# Altium schematic sheet Sheet1.SchDoc
size A3; SheetNumber: 1; SheetTotal: 1
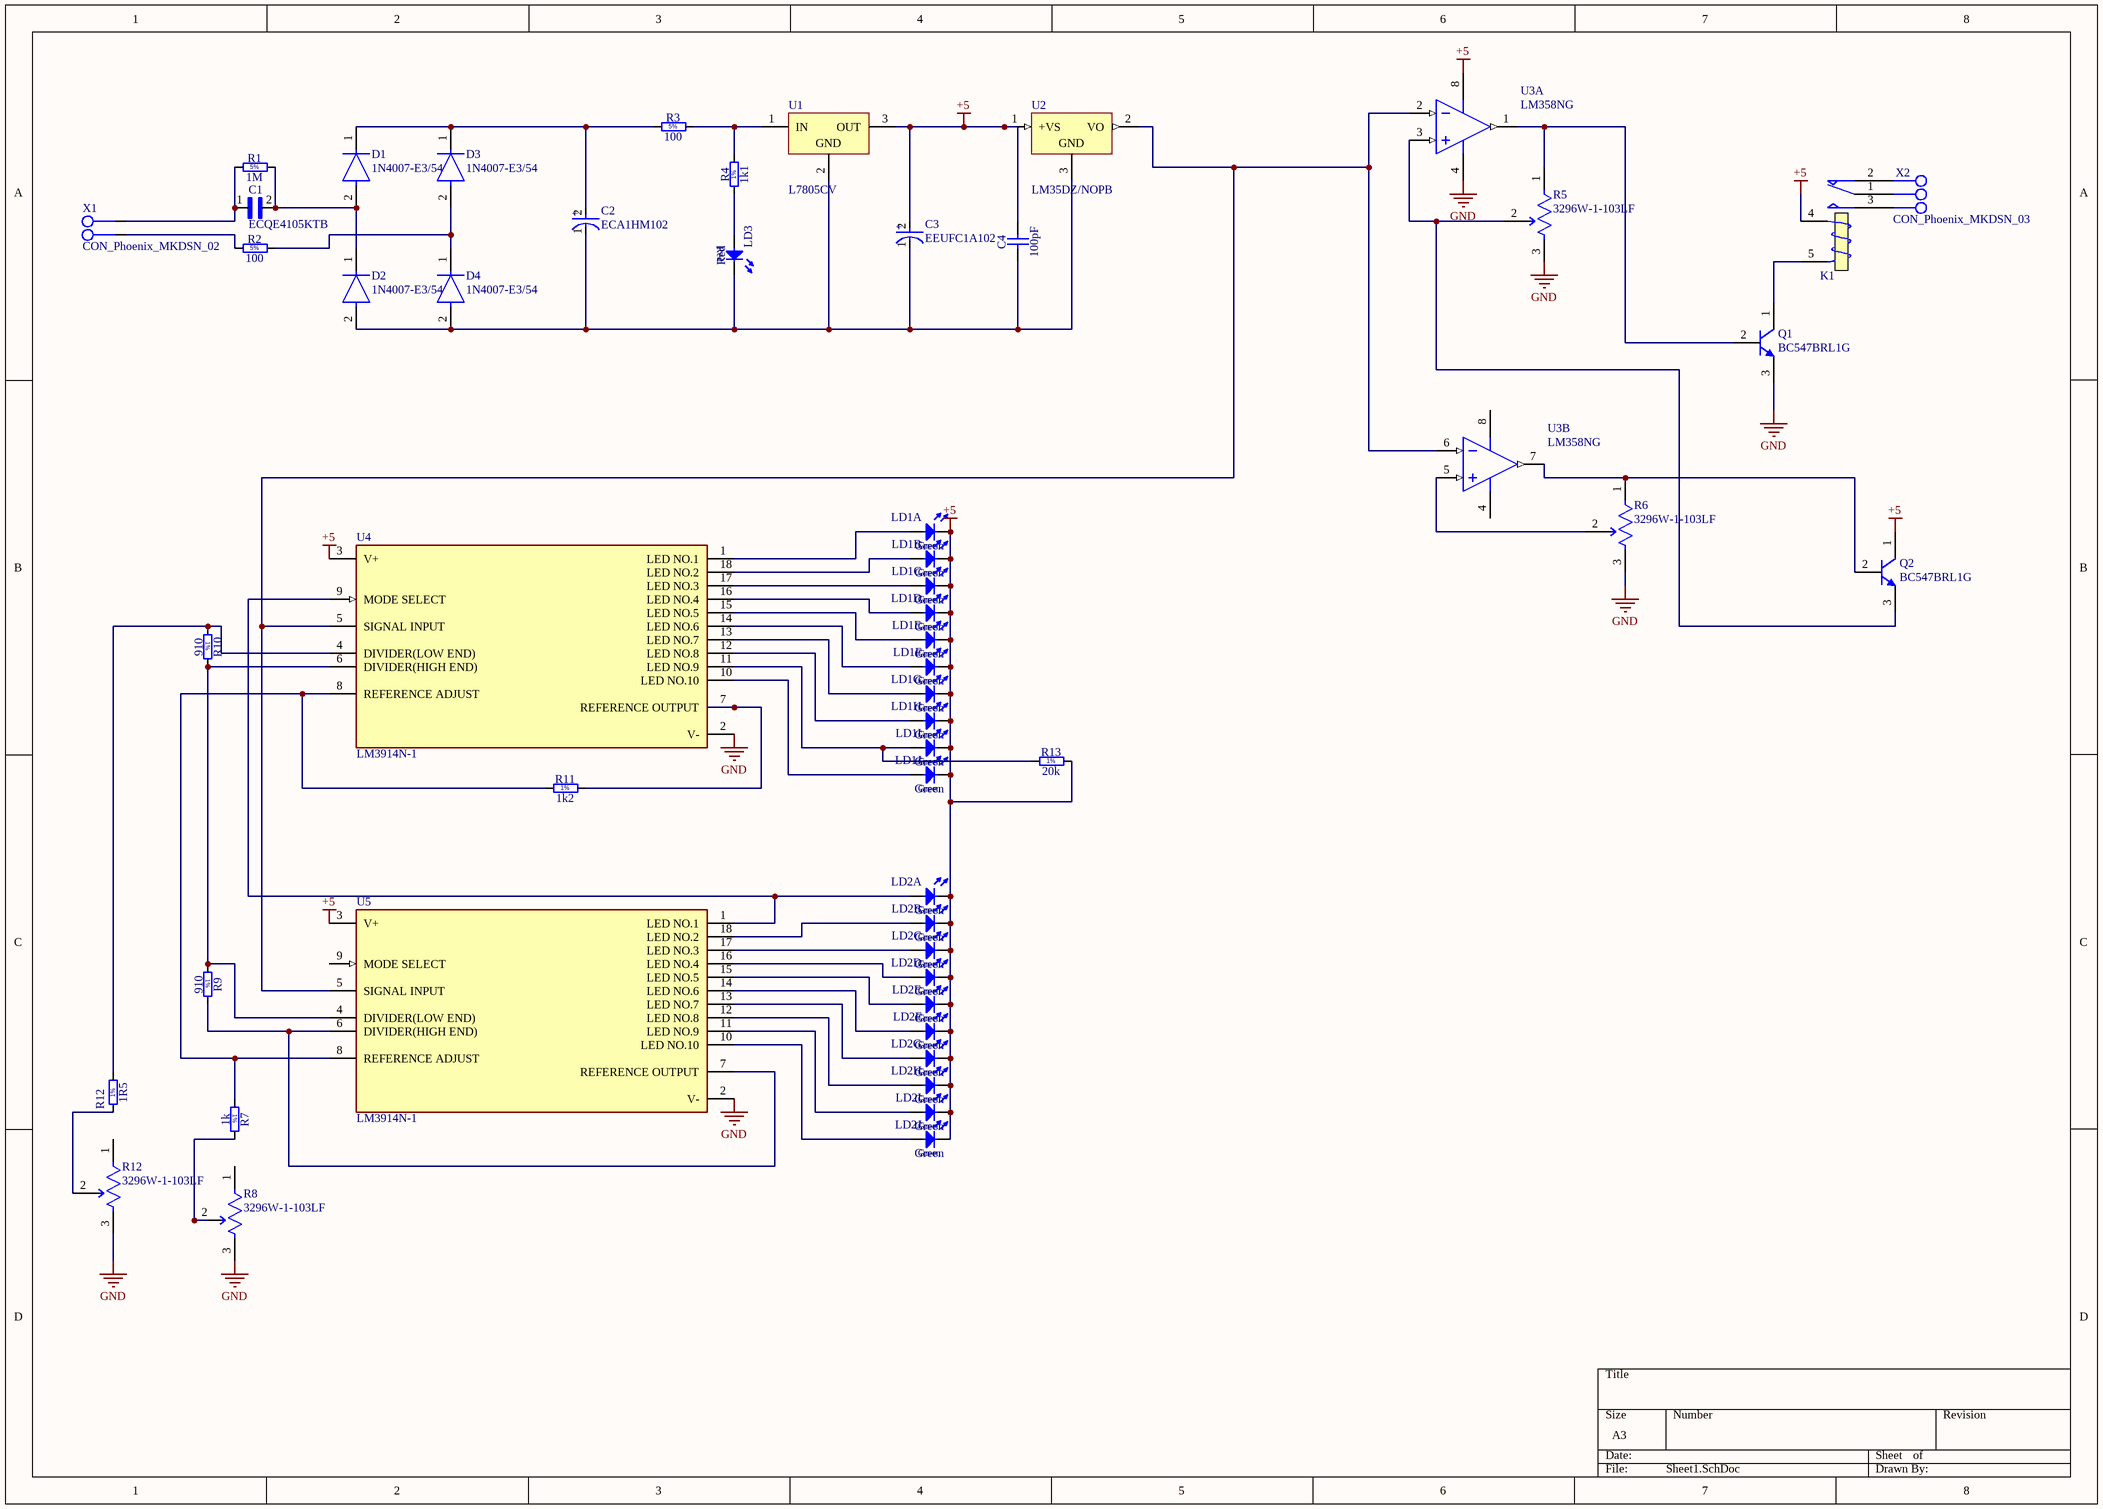
[diagram p0: Sheet1.SchDoc]

## Parts
(Parts that share a designator on the sheet are numbered #1, #2 ... from top to bottom, then left to right.)
C1  ECQE4105KTB  [CAPRR1500W80L2650T850H2300]
C2  ECA1HM102  [FP-RAD-TH-D_12_5_0_5-L_25-MFG]
C3  EEUFC1A102  [FP-RAD-TH-D_10_0_5-L_16_1-MFG]
C4  100pF  [CAPRR508-254X381X584]
D1  1N4007-E3/54  [FP-1N4007-MFG]
D2  1N4007-E3/54  [FP-1N4007-MFG]
D3  1N4007-E3/54  [FP-1N4007-MFG]
D4  1N4007-E3/54  [FP-1N4007-MFG]
K1  Relay 5pin Milon 5V  [REL_MILON]  (value not drawn)
LD1  Green  [LED_MENTOR_2633.1180]  (parts A,B,C,D,E,F,G,H,I,J of 10)
LD2  Green  [LED_MENTOR_2633.1180]  (parts A,B,C,D,E,F,G,H,I,J of 10)
LD3  Red  [LED_3MM_RED_1C-2A]
Q1  BC547BRL1G  [ONSC-TO-92-3-29-11_AM_BL]
Q2  BC547BRL1G  [ONSC-TO-92-3-29-11_AM_BL]
R1  1M  [RES2286-1670X520]
R2  100  [RES2286-1670X520]
R3  100  [RES2286-1670X520]
R4  1k1  [RES1016-630X250]
R5  3296W-1-103LF  [FP-3296W-MFG]
R6  3296W-1-103LF  [FP-3296W-MFG]
R7  1k  [RES1016-630X250]
R8  3296W-1-103LF  [FP-3296W-MFG]
R9  910  [RES1016-630X250]
R10  910  [RES1016-630X250]
R11  1k2  [RES1016-630X250]
R12#1  1R5  [RES1016-630X250]
R12#2  3296W-1-103LF  [FP-3296W-MFG]
R13  20k  [RES1016-630X250]
U1  L7805CV  [TO220]
U2  LM35DZ/NOPB  [LP0003A]
U3  LM358NG  [ONSC-PDIP-8-626-05_M]  (parts A,B of 2)
U4  LM3914N-1  [FP-NFK0018A-MFG]
U5  LM3914N-1  [FP-NFK0018A-MFG]
X1  CON_Phoenix_MKDSN_02  [CON_MKDSN1,5/2-5,08]
X2  CON_Phoenix_MKDSN_03  [CON_MKDSN1,5/3-5,08]

## Nets
+5: C3.2(A) C4.2 K1.4(T1) LD1.C1 LD1.C2 LD1.C3 LD1.C4 LD1.C5 LD1.C6 LD1.C7 LD1.C8 LD1.C9 LD1.C10 LD2.C1 LD2.C2 LD2.C3 LD2.C4 LD2.C5 LD2.C6 LD2.C7 LD2.C8 LD2.C9 LD2.C10 Q2.1(C) R13.2 U1.3(OUT) U2.1(+VS) U3.8(VCC) U4.3(V+) U5.3(V+)
GND: Q1.3(E) R5.3(CW) R6.3(CW) R8.3(CW) R12#2.3(CW) U3.4(VEE/GND) U4.2(V-) U5.2(V-)
NetC1_1: C1.1 R1.1 X1.2
NetC1_2: C1.2 D1.2(A) D2.1(C) R1.2
NetC2_1: C2.1(C) C3.1(C) C4.1 D2.2(A) D4.2(A) LD3.1(C) U1.2(GND) U2.3(GND)
NetC2_2: C2.2(A) D1.1(C) D3.1(C) R3.1
NetD3_2: D3.2(A) D4.1(C) R2.2
NetK1_1: K1.1(COM) X2.2
NetK1_2: K1.2(NC) X2.1
NetK1_3: K1.3(NO) X2.3
NetK1_5: K1.5(T2) Q1.1(C)
NetLD1_A1: LD1.A1 U4.1(LED_NO.1)
NetLD1_A2: LD1.A2 U4.18(LED_NO.2)
NetLD1_A3: LD1.A3 U4.17(LED_NO.3)
NetLD1_A4: LD1.A4 U4.16(LED_NO.4)
NetLD1_A5: LD1.A5 U4.15(LED_NO.5)
NetLD1_A6: LD1.A6 U4.14(LED_NO.6)
NetLD1_A7: LD1.A7 U4.13(LED_NO.7)
NetLD1_A8: LD1.A8 U4.12(LED_NO.8)
NetLD1_A9: LD1.A9 R13.1 U4.11(LED_NO.9)
NetLD1_A10: LD1.A10 U4.10(LED_NO.10)
NetLD2_A1: LD2.A1 U4.9(MODE_SELECT) U5.1(LED_NO.1)
NetLD2_A2: LD2.A2 U5.18(LED_NO.2)
NetLD2_A3: LD2.A3 U5.17(LED_NO.3)
NetLD2_A4: LD2.A4 U5.16(LED_NO.4)
NetLD2_A5: LD2.A5 U5.15(LED_NO.5)
NetLD2_A6: LD2.A6 U5.14(LED_NO.6)
NetLD2_A7: LD2.A7 U5.13(LED_NO.7)
NetLD2_A8: LD2.A8 U5.12(LED_NO.8)
NetLD2_A9: LD2.A9 U5.11(LED_NO.9)
NetLD2_A10: LD2.A10 U5.10(LED_NO.10)
NetLD3_2: LD3.2(A) R4.1
NetQ1_2: Q1.2(B) R5.1(CCW) U3.1(OUTA)
NetQ2_2: Q2.2(B) R6.1(CCW) U3.7(OUTB)
NetQ2_3: Q2.3(E) R5.2(WIPER) U3.3(INA+)
NetR2_1: R2.1 X1.1
NetR3_2: R3.2 R4.2 U1.1(IN)
NetR6_2: R6.2(WIPER) U3.5(INB+)
NetR7_1: R7.1 R11.1 U4.8(REFERENCE_ADJUST) U5.8(REFERENCE_ADJUST)
NetR7_2: R7.2 R8.2(WIPER)
NetR9_1: R9.1 R10.2 U4.6(DIVIDER(HIGH_END)) U5.4(DIVIDER(LOW_END))
NetR9_2: R9.2 U5.6(DIVIDER(HIGH_END)) U5.7(REFERENCE_OUTPUT)
NetR10_1: R10.1 R12#1.2 U4.4(DIVIDER(LOW_END))
NetR11_2: R11.2 U4.7(REFERENCE_OUTPUT)
NetR12#1_1: R12#1.1 R12#2.2(WIPER)
NetU2_2: U2.2(VO) U3.2(INA-) U3.6(INB-) U4.5(SIGNAL_INPUT) U5.5(SIGNAL_INPUT)

Not connected (* = marked no-connect by the designer): R8 1(CCW); R12#2 1(CCW); U5 9(MODE_SELECT)

## Notes on the sheet
- (in symbol CMP-05427-000979-1) +
- (in symbol CMP-05427-001975-1) +
- (in symbol RMF_1K1_1%_0.6W_50PPM_1016-630X250) 1%
- (in symbol RMF_1K2_1%_0.6W_50PPM_1016-630X250) 1%
- (in symbol RMF_1K_1%_0.6W_50PPM_1016-630X250) 1%
- (in symbol RMF_1M_5%_3W_250PPM_2286-1670X520) 5%
- (in symbol RMF_1R5_1%_0.6W_50PPM_1016-630X250) 1%
- (in symbol RMF_20K_1%_0.6W_50PPM_1016-630X250) 1%
- (in symbol RMF_100R_5%_3W_250PPM_2286-1670X520) 5%
- (in symbol RMF_910R_1%_0.6W_50PPM_1016-630X250) 1%

## Library data of the parts
C2 = CMP-05427-001975-1: Aluminum Electrolytic Capacitors (Radial Lead Type) 1000uF ±20% 50V; Lead Diameter: 0.6mm; Polarity: Polar; Lead/Base Style: Straight; Ripple Current: 1.05A; Life (Hours): 2000Hour; Dissipation Factor: 0.12%; Capacitance: 1mF; Diameter: 12.5mm; Height: 25mm; Construction: RADIAL; Voltage Rating (DC): 50V; Tolerance: 20%; Package Quantity: 200; Min Operating Temperature: -40°C; Packaging: Bulk; Max Operating Temperature: 85°C; Case/Package: Radial; Radiation Hardening: No; Mount: Through Hole; Length: 25mm; Termination: Radial; Voltage Rating: 50V; RoHS Compliant: Yes; Height - Seated (Max): 1.063inch; REACH SVHC: No SVHC; Series: M; Lead Pitch: 5mm
C3 = CMP-05427-000979-1: Aluminum Electrolytic Capacitors (Radial Lead Type) AEC-Q200 Qualified 1000uF ±20% 10V; Leakage Current: 3uA; Lead Diameter: 0.6mm; Ripple Current: 1.05A; ESR (Equivalent Series Resistance): 68mR; Life (Hours): 3000Hour; Capacitance: 1mF; Dielectric Material: Aluminium; Packaging: Bulk; Lead Free: Lead Free; Min Operating Temperature: -55°C; Case/Package: Radial; Mount: Through Hole; Termination: Radial; Voltage: 10V; Height: 16mm; Lead Pitch: 5mm; RoHS Compliant: Yes; Voltage Rating (DC): 10V; Length: 16mm; Package Quantity: 200; Max Operating Temperature: 105°C; Ratings: AEC-Q200; Radiation Hardening: No; Contact Plating: Tin; Size: 16mm; Height - Seated (Max): 0.63inch; Diameter: 10mm; REACH SVHC: No SVHC; Series: FC; Construction: RADIAL; Voltage Rating: 10V; Tolerance: 20%; Impedance: 68mR
C4 = CCR_100PF_100V_5%_COG_508-254X381X584: Non-polarised capacitor; Part Description: Radial Lead Type Multilayer Ceramic Capacitor; Manufacturer: GENERIC; Manufacturer1 Part Number: C317C101J1G5TA; Voltage: 100VDC; TC: COG; Tolerance: ±5%; Table: Capacitors THD; Part Number: CCR_100PF_100V_5%_COG_508-254X381X584; Component Kind: Standard; Component Type: Standard; Pin Count: 2; Value: 100pF; Status: None; Manufacturer Part Number: CCR_100PF_100V_5%_COG_508-254X381X584; Case: LS5.08 W2.54 x L3.81 x H5.84; Mounted: Yes; Socket: No; SMD: No; ComponentHeight: 5.84mm; Manufacturer1 Example: KEMET; Manufacturer1 ComponentHeight: 5.84mm; HelpURL: \\cern.ch\dfs\Applications\Altium\Datasheets\CCR_KEMET_C317.pdf; Author: CERN DEM JLC; CreateDate: 12/17/2008; LatestRevisionDate: 12/17/2008
D1-D4 = CMP-02540-000046-1: DIODE GEN PURP 1KV 1A DO204AL; Manufacturer: Vishay; Value: 15pF; Max Junction Temp: +150°C; Max Surge Forward Current: 30A; Max Repetitive Reverse Voltage: 1000V; Peak Reverse Current: 30uA; Octopart: https://octopart.com/1n4007-e3%2F54-vishay-39548207; Digikey Description: DIODE GEN PURP 1KV 1A DO204AL; Category: Diode; Mouser Description: Rectifiers Vr/1000V Io/1A; Automotive: No; Package: 1N4007; Device Class L3: Rectifier Diodes; Temperature Range High: +150°C; Capacitance: 15pF; Ipc Land Pattern Name: DIOPA1088W105L520D270; Lead Free: Yes; ComponentLink2Description: Datasheet; Forward Current: 1A; Device Class L1: Discrete Semiconductors; ComponentLink2URL: http://www.vishay.com/docs/88503/1n4001.pdf; Temperature Range Low: -50°C; Height: 2.7mm; RoHS: TRUE; Temperature: -50°C to +150°C; Device Class L2: Diodes; Manufacturer Part Number: 1N4007-E3/54
K1 = Relay 5pin Milon 5V: PartNumber: HJR-21FF-S-Z-05VDC
LD1 LD2 = LED_MENTOR_2633.1180: 10x Diameter 5mm Green LED Vertical LED Array; Manufacturer: MENTOR; Table: LEDs & Displays; Part Number: LED_MENTOR_2633.1180; Component Kind: Standard; Component Type: Standard; Color: Green; PackageDescription: 10x Diameter 5mm Green LED Vertical LED Array; Part Description: 10x Diameter 5mm Green LED Vertical LED Array; Manufacturer Part Number: 2633.1180; Pin Count: 20; Mounted: Yes; Socket: No; SMD: No; ComponentHeight: 17.1mm; HelpURL: \\cern.ch\dfs\Applications\Altium\Datasheets\LED_MENTOR_2633.1180.pdf; Author: CERN DEM JLC; CreateDate: 11/28/2012; LatestRevisionDate: 3/7/2013
LD3 = LED_AVAGO_HLMP-1700: LED Red 1C 2A; Part Description: 3mm Red LED; Manufacturer: AVAGO TECHNOLOGIES; Table: LEDs & Displays; Part Number: LED_AVAGO_HLMP-1700; Component Kind: Standard; Component Type: Standard; Color: Red; PackageDescription: LED, Red, Body Dia. 3.43 mm, Pin spacing 2.54mm; Manufacturer Part Number: HLMP-1700; Pin Count: 2; Mounted: Yes; Socket: No; SMD: No; ComponentHeight: 6.35mm(min); HelpURL: \\cern.ch\dfs\Applications\Altium\Datasheets\LED_AVAGO_HLMP-1700.pdf; Author: CERN DEM JLC; CreateDate: 6/12/2008; LatestRevisionDate: 3/17/2010
Q1 Q2 = CMP-1048-01605-1: Amplifier Transistor, NPN Silicon, 3-Pin TO-92, Pb-Free, Tape and Reel; Manufacturer: On Semiconductor; IC Continuous (A): 0.1; fT Min (MHz): 150; ComponentLink2URL: http://www.onsemi.com/pub_link/Collateral/BC546-D.PDF; ComponentLink1URL: http://www.onsemi.com/; ComponentLink2Description: Datasheet; RoHS: TRUE; ComponentLink3Description: Package Specification; ComponentLink1Description: Manufacturer URL; ComponentLink3URL: http://www.onsemi.com/pub_link/Collateral/MAC97-D.PDF; PackageDescription: 3-Pin Transistor Outline, Body 4.825 x 3.685 mm, Pitch 1.27 mm; Packing: Tape and Reel; PackageVersion: Rev. AM; Polarity: NPN; DatasheetVersion: Rev. 7; Mounting Technology: Through Hole; PackageReference: TO-92-3-29-11_AM_BL; PartNumber: BC547BRL1G
R1 = RMF_1M_5%_3W_250PPM_2286-1670X520: Resistor - 5%; Part Description: Leaded Power Metal Film Resistor; Manufacturer: GENERIC; Manufacturer1 Part Number: PR03000201004JAC00; Power: 3W; TC: ±250ppm/°C; Table: Resistors THD; Part Number: RMF_1M_5%_3W_250PPM_2286-1670X520; Component Kind: Standard; Component Type: Standard; Pin Count: 2; Value: 1M; Status: Preferred; Tolerance: ±5%; Manufacturer Part Number: RMF_1M_5%_3W_250PPM_2286-1670X520; Case: LS22.86 L16.7 x D5.2; Mounted: Yes; Socket: No; SMD: No; ComponentHeight: 5.2mm; Manufacturer1 Example: VISHAY BCCOMPONENT; Manufacturer1 ComponentHeight: 5.2mm; HelpURL: \\cern.ch\dfs\Applications\Altium\Datasheets\RMF_VISHAY_PR03.pdf; Author: CERN DEM JLC; CreateDate: 6/23/2008; LatestRevisionDate: 10/1/2012
R2 R3 = RMF_100R_5%_3W_250PPM_2286-1670X520: Resistor - 5%; Part Description: Leaded Power Metal Film Resistor; Manufacturer: GENERIC; Manufacturer1 Part Number: PR03000201000JAC00; Power: 3W; TC: ±250ppm/°C; Table: Resistors THD; Part Number: RMF_100R_5%_3W_250PPM_2286-1670X520; Component Kind: Standard; Component Type: Standard; Pin Count: 2; Value: 100; Status: Preferred; Tolerance: ±5%; Manufacturer Part Number: RMF_100R_5%_3W_250PPM_2286-1670X520; Case: LS22.86 L16.7 x D5.2; Mounted: Yes; Socket: No; SMD: No; ComponentHeight: 5.2mm; Manufacturer1 Example: VISHAY BCCOMPONENT; Manufacturer1 ComponentHeight: 5.2mm; HelpURL: \\cern.ch\dfs\Applications\Altium\Datasheets\RMF_VISHAY_PR03.pdf; Author: CERN DEM JLC; CreateDate: 6/19/2008; LatestRevisionDate: 10/1/2012
R4 = RMF_1K1_1%_0.6W_50PPM_1016-630X250: Resistor - 1%; Part Description: Leaded Metal Film Resistor; Manufacturer: GENERIC; Manufacturer1 Part Number: MBB02070C1101FCT00; Power: 0.6W; TC: ±50ppm/°C; Table: Resistors THD; Part Number: RMF_1K1_1%_0.6W_50PPM_1016-630X250; Component Kind: Standard; Component Type: Standard; Pin Count: 2; Value: 1k1; Status: Preferred; Tolerance: ±1%; Manufacturer Part Number: RMF_1K1_1%_0.6W_50PPM_1016-630X250; Case: LS10.16 L6.3 x D2.5; Mounted: Yes; Socket: No; SMD: No; ComponentHeight: 2.5mm; Manufacturer1 Example: VISHAY BEYSCHLAG; Manufacturer1 ComponentHeight: 2.5mm; HelpURL: \\cern.ch\dfs\Applications\Altium\Datasheets\RMF_VISHAY_MBB0207.pdf; Author: CERN DEM JLC; CreateDate: 12/4/2007; LatestRevisionDate: 4/7/2008
R5 R6 R8 R12#2 = CMP-1747-00001-5: TRIMMER 10K OHM 0.5W PC PIN TOP; Power Rating: 500mW; Resistance: 10kR; Tolerance: 10%; Insulation Resistance: 1GR; Number of Turns: 25; Temperature Coefficient: 100ppm/°C; Weight: 0.03oz; Package Quantity: 50; Radiation Hardening: No; Max Power Dissipation: 500mW; Height: 11.55mm; Military Standard: Not; Contact Plating: Tin; Width: 9.53mm; Lead Free: Lead Free; Min Operating Temperature: -55°C; Taper: Linear; RoHS Compliant: Yes; Color: Blue; Depth: 4.83mm; Termination: Pin; Resistor Type: Cermet; Max Operating Temperature: 125°C; Mount: Through Hole; Technology: CERMET; Reach SVHC Compliant: Yes; Packaging: Rail/Tube; Series: 3296; Length: 9.53mm; Resistance Tolerance: 10%
R7 = RMF_1K_1%_0.6W_50PPM_1016-630X250: Resistor - 1%; Part Description: Leaded Metal Film Resistor; Manufacturer: GENERIC; Manufacturer1 Part Number: MBB02070C1001FCT00; Power: 0.6W; TC: ±50ppm/°C; Table: Resistors THD; Part Number: RMF_1K_1%_0.6W_50PPM_1016-630X250; Component Kind: Standard; Component Type: Standard; Pin Count: 2; Value: 1k; Status: Preferred; Tolerance: ±1%; Manufacturer Part Number: RMF_1K_1%_0.6W_50PPM_1016-630X250; Case: LS10.16 L6.3 x D2.5; Mounted: Yes; Socket: No; SMD: No; ComponentHeight: 2.5mm; Manufacturer1 Example: VISHAY BEYSCHLAG; Manufacturer1 ComponentHeight: 2.5mm; HelpURL: \\cern.ch\dfs\Applications\Altium\Datasheets\RMF_VISHAY_MBB0207.pdf; Author: CERN DEM JLC; CreateDate: 12/4/2007; LatestRevisionDate: 4/7/2008
R9 R10 = RMF_910R_1%_0.6W_50PPM_1016-630X250: Resistor - 1%; Part Description: Leaded Metal Film Resistor; Manufacturer: GENERIC; Manufacturer1 Part Number: MBB02070C9100FCT00; Power: 0.6W; TC: ±50ppm/°C; Table: Resistors THD; Part Number: RMF_910R_1%_0.6W_50PPM_1016-630X250; Component Kind: Standard; Component Type: Standard; Pin Count: 2; Value: 910; Status: Preferred; Tolerance: ±1%; Manufacturer Part Number: RMF_910R_1%_0.6W_50PPM_1016-630X250; Case: LS10.16 L6.3 x D2.5; Mounted: Yes; Socket: No; SMD: No; ComponentHeight: 2.5mm; Manufacturer1 Example: VISHAY BEYSCHLAG; Manufacturer1 ComponentHeight: 2.5mm; HelpURL: \\cern.ch\dfs\Applications\Altium\Datasheets\RMF_VISHAY_MBB0207.pdf; Author: CERN DEM JLC; CreateDate: 12/4/2007; LatestRevisionDate: 4/7/2008
R11 = RMF_1K2_1%_0.6W_50PPM_1016-630X250: Resistor - 1%; Part Description: Leaded Metal Film Resistor; Manufacturer: GENERIC; Manufacturer1 Part Number: MBB02070C1201FCT00; Power: 0.6W; TC: ±50ppm/°C; Table: Resistors THD; Part Number: RMF_1K2_1%_0.6W_50PPM_1016-630X250; Component Kind: Standard; Component Type: Standard; Pin Count: 2; Value: 1k2; Status: Preferred; Tolerance: ±1%; Manufacturer Part Number: RMF_1K2_1%_0.6W_50PPM_1016-630X250; Case: LS10.16 L6.3 x D2.5; Mounted: Yes; Socket: No; SMD: No; ComponentHeight: 2.5mm; Manufacturer1 Example: VISHAY BEYSCHLAG; Manufacturer1 ComponentHeight: 2.5mm; HelpURL: \\cern.ch\dfs\Applications\Altium\Datasheets\RMF_VISHAY_MBB0207.pdf; Author: CERN DEM JLC; CreateDate: 12/4/2007; LatestRevisionDate: 4/7/2008
R12#1 = RMF_1R5_1%_0.6W_50PPM_1016-630X250: Resistor - 1%; Part Description: Leaded Metal Film Resistor; Manufacturer: GENERIC; Manufacturer1 Part Number: MBB02070C1508FCT00; Power: 0.6W; TC: ±50ppm/°C; Table: Resistors THD; Part Number: RMF_1R5_1%_0.6W_50PPM_1016-630X250; Component Kind: Standard; Component Type: Standard; Pin Count: 2; Value: 1R5; Status: Not recommended; Tolerance: ±1%; Manufacturer Part Number: RMF_1R5_1%_0.6W_50PPM_1016-630X250; Case: LS10.16 L6.3 x D2.5; Mounted: Yes; Socket: No; SMD: No; ComponentHeight: 2.5mm; Manufacturer1 Example: VISHAY BEYSCHLAG; Manufacturer1 ComponentHeight: 2.5mm; HelpURL: \\cern.ch\dfs\Applications\Altium\Datasheets\RMF_VISHAY_MBB0207.pdf; Author: CERN DEM JLC; CreateDate: 12/4/2007; LatestRevisionDate: 4/7/2008
R13 = RMF_20K_1%_0.6W_50PPM_1016-630X250: Resistor - 1%; Part Description: Leaded Metal Film Resistor; Manufacturer: GENERIC; Manufacturer1 Part Number: MBB02070C2002FCT00; Power: 0.6W; TC: ±50ppm/°C; Table: Resistors THD; Part Number: RMF_20K_1%_0.6W_50PPM_1016-630X250; Component Kind: Standard; Component Type: Standard; Pin Count: 2; Value: 20k; Status: Preferred; Tolerance: ±1%; Manufacturer Part Number: RMF_20K_1%_0.6W_50PPM_1016-630X250; Case: LS10.16 L6.3 x D2.5; Mounted: Yes; Socket: No; SMD: No; ComponentHeight: 2.5mm; Manufacturer1 Example: VISHAY BEYSCHLAG; Manufacturer1 ComponentHeight: 2.5mm; HelpURL: \\cern.ch\dfs\Applications\Altium\Datasheets\RMF_VISHAY_MBB0207.pdf; Author: CERN DEM JLC; CreateDate: 12/4/2007; LatestRevisionDate: 4/7/2008
U1 = CMP-0244-00483-1: Positive Voltage Regulator, 5V, 3-Pin TO-220; PackageDescription: TO, Thru-Hole, Vertical, Heatsink Mounted; 3 In-Line Leads; Pitch 2.54 mm; ComponentLink2Description: Datasheet; PackageReference: TO220; ComponentLink3URL: http://www.st.com/internet/com/TECHNICAL_RESOURCES/TECHNICAL_LITERATURE/PACKAGE_INFORMATION/CD00004649.pdf; DatasheetVersion: 16/11/2011; ComponentLink1Description: Manufacturer URL; ComponentLink1URL: http://www.st.com; PackageVersion: ver3.0; ComponentLink3Description: Package Specification; ComponentLink2URL: http://www.st.com/internet/com/TECHNICAL_RESOURCES/TECHNICAL_LITERATURE/DATASHEET/CD00000444.pdf
U2 = CMP-0066-00030-3: Precision Centigrade Temperature Sensor, 3-pin TO-92, Pb-Free; Manufacturer: Texas Instruments; PowerWise: N; PackageTopMarking: NSXYTT*LM35*DZ; CompType: Temp Sensor IC; RoHS: Y; PackageReference: LP0003A; PinCount: 3; ComponentLink1URL: http://www.ti.com/general/docs/lit/getliterature.tsp?genericPartNumber=LM35&fileType=pdf; Code_JEDEC: TO-226-AA; PackageDescription: TO-92, Molded, 3 Lead; ComponentLink1Description: Datasheet URL
U3 = CMP-1310-00096-1: Single Supply Dual Operational Amplifier, 3 to 32 V, 0 to 70 degC, 8-Pin PDIP, Pb-Free, Tube; Manufacturer: On Semiconductor; VCC Max (V): 32; VCC Min (V): 3; ComponentLink1URL: http://www.onsemi.com/; DatasheetVersion: Rev. 27; PackageReference: PDIP-8-626-05; PartNumber: LM358NG; ComponentLink1Description: Manufacturer URL; ComponentLink3URL: http://www.onsemi.com/pub_link/Collateral/LM211-D.PDF; Mounting Technology: Through Hole; ComponentLink2URL: http://www.onsemi.cn/pub_link/Collateral/LM358-D.PDF; PackageDescription: 8-Pin Plastic Dual-In Line Package, Body 9.52 x 6.605 mm, Pitch 2.54 mm; PackageVersion: Rev. M, 04/2010; ComponentLink3Description: Package Specification; ComponentLink2Description: Datasheet; Packing: Tube; RoHS: TRUE
U4 U5 = CMP-0058-00006-4: IC DRVR DOT/BAR DISPLAY 18DIP; Output Current: 30mA; Supply Current: 9.2mA; Output Voltage: 1.28V; Number of Outputs: 10; Max Output Voltage: 1.34V; Power Dissipation: 1.365W; Operating Supply Current: 6.1mA; Max Input Voltage: 12V; Max Supply Current: 9.2kA; Min Input Voltage: 1.2V; Max Supply Voltage: 25V; Length: 22.86mm; Max Operating Temperature: 70°C; Number of Pins: 18; Radiation Hardening: No; Min Operating Temperature: 0°C; Width: 6.35mm; Nominal Supply Current: 9.2mA; Number of Channels: 10; Packaging: Rail/Tube; Max Power Dissipation: 1.365W; Height: 3.3mm; Package Quantity: 20; REACH SVHC: No SVHC; Mount: Through Hole; Lead Free: Contains Lead; Series: -; Termination: Through Hole; Number of Segments: 10; Case/Package: DIP; RoHS Compliant: No
X1 = CON_Phoenix_MKDSN_02: Manufacturer: PHOENIX CONTACT; Company: SJ Libraries; Connector type: PCB Terminal Block; designer: Eng. Saeid Jorablo; Max Current: 13.5 A; Positions: 2; Revision 1: 2012/10/1 : Adding Model; Voltage: 400 V; Category: Connector; ComponentLink1Description: Datasheet; ComponentLink2Description: Reference; HelpURL: http://s3.picofile.com/file/7443264187/Coming_Soon_logo.gif; Mounting Technology: Through-Hole; Pin Count: 2; Publisher: SJ UnLimited; Status: Unreleased; Update: 2012/10/1
X2 = CON_Phoenix_MKDSN_03: Manufacturer: PHOENIX CONTACT; Company: SJ Libraries; Connector type: PCB Terminal Block; designer: Eng. Saeid Jorablo; Max Current: 13.5 A; Positions: 3; Revision 1: 2012/10/1 : Adding Model; Voltage: 400 V; Category: Connector; ComponentLink1Description: Datasheet; ComponentLink2Description: Reference; HelpURL: http://s3.picofile.com/file/7443264187/Coming_Soon_logo.gif; Mounting Technology: Through-Hole; Pin Count: 3; Publisher: SJ UnLimited; Status: Unreleased; Update: 2012/10/1
C1 = ECQE4105KTB: Price: None; MP: ECQE4105KTB; Value: *; Availability: Unavailable; Package: None